# Altium schematic sheet tof.SchDoc
size A
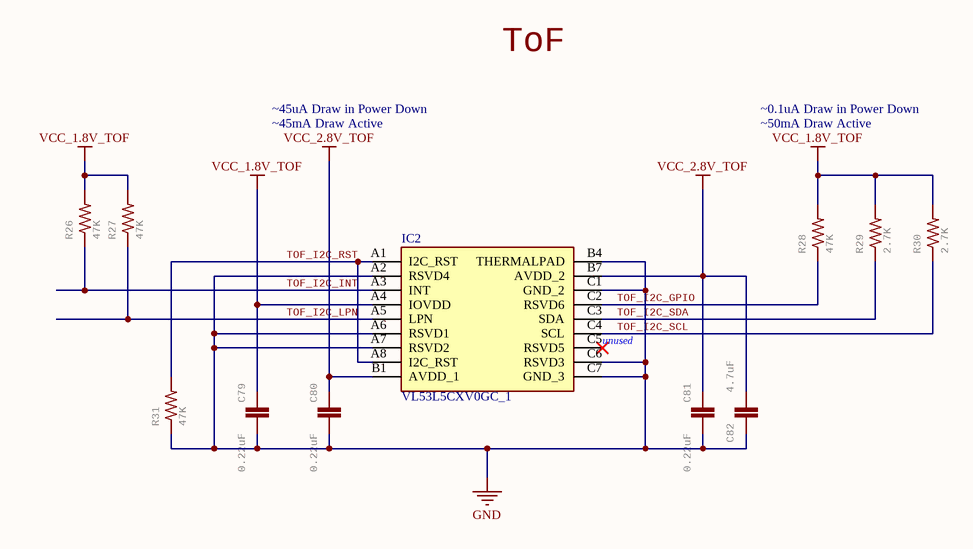
[diagram p0: tof.SchDoc]

## Parts
C79  0.22uF  [C0201]
C80  0.22uF  [C0201]
C81  0.22uF  [C0201]
C82  4.7uF  [0402-CAP]
IC2  VL53L5CXV0GC_1  [VL53L5CXV0GC1]
R26  47K  [R0201]
R27  47K  [R0201]
R28  47K  [R0201]
R29  2.7K  [R0201]
R30  2.7K  [R0201]
R31  47K  [R0201]

## Nets
GND: C79.2 C80.2 C81.2 C82.1 IC2.A2(RSVD4) IC2.A6(RSVD1) IC2.A7(RSVD2) IC2.B4(THERMALPAD) IC2.C1(GND_2) IC2.C6(RSVD3) IC2.C7(GND_3) R31.1
VCC_1.8V_TOF: C79.1 IC2.A4(IOVDD) R26.2 R27.2 R28.2 R29.2 R30.2
VCC_2.8V_TOF: C80.1 C81.1 C82.2 IC2.B1(AVDD_1) IC2.B7(AVDD_2)
TOF_I2C_GPIO: IC2.C2(RSVD6) R28.1
TOF_I2C_INT: IC2.A3(INT) R26.1
TOF_I2C_LPN: IC2.A5(LPN) R27.1
TOF_I2C_RST: IC2.A1(I2C_RST) IC2.A8(I2C_RST) R31.2
TOF_I2C_SCL: IC2.C4(SCL) R30.1
TOF_I2C_SDA: IC2.C3(SDA) R29.1

Not connected (* = marked no-connect by the designer): IC2 C5(RSVD5)*

## Notes on the sheet
- ~45uA Draw in Power Down
- ToF
- ~0.1uA Draw in Power Down
- ~45mA Draw Active
- ~50mA Draw Active
- (near IC2) unused

## Library data of the parts
C79-C81 = C-EUC0201: CAPACITOR, European symbol; MPN: GRM033R60J224ME15D; GateName_1: G$1; SymbolName_1: C-EU; POPULARITY: 0; DeviceName: C0201; LibraryName: rcl; DeviceSetName: C-EU; SPICEPREFIX: C; Part Number: GRM033R60J224ME15D
C82 = CAP_0402: 0402 (1005 Metric) Nick Garner - TeleSense; MPN: JMK105BBJ475MV-F; GateName_1: G$1; SymbolName_1: CAP; LibraryName: 0402; DeviceSetName: CAP_0402
IC2 = VL53L5CXV0GC_1: Integrated Circuit; Manufacturer_Name: STMicroelectronics; Manufacturer_Part_Number: VL53L5CXV0GC/1; Datasheet Link: https://www.arrow.com/en/products/vl53l5cxv0gc1/stmicroelectronics?region=nac; Height: 1.55mm; Mouser Part Number: 511-VL53L5CXV0GC/1; Mouser Price/Stock: https://www.mouser.co.uk/ProductDetail/STMicroelectronics/VL53L5CXV0GC-1?qs=QNEnbhJQKvZPmRJw6ASPyw%3D%3D; Arrow Part Number: VL53L5CXV0GC/1; Arrow Price/Stock: https://www.arrow.com/en/products/vl53l5cxv0gc1/stmicroelectronics?region=nac; Part Number: VL53L5CXV0GC/1; MPN: VL53L5CXV0GC/1
R26-R28 R31 = RESISTOR0402-RES: MPN: RMCF0201FT47K0; GateName_1: G$1; SymbolName_1: RESISTOR; LibraryName: sfe; DeviceSetName: RESISTOR; Part Number: RMCF0201FT47K0
R29 R30 = RESISTOR0402-RES: MPN: RC0201JR-072K7L; GateName_1: G$1; SymbolName_1: RESISTOR; LibraryName: sfe; DeviceSetName: RESISTOR; Part Number: RC0201JR-072K7L